# EAGLE design SparkX_smol_LiPo_Power (EAGLE 9.6.2)
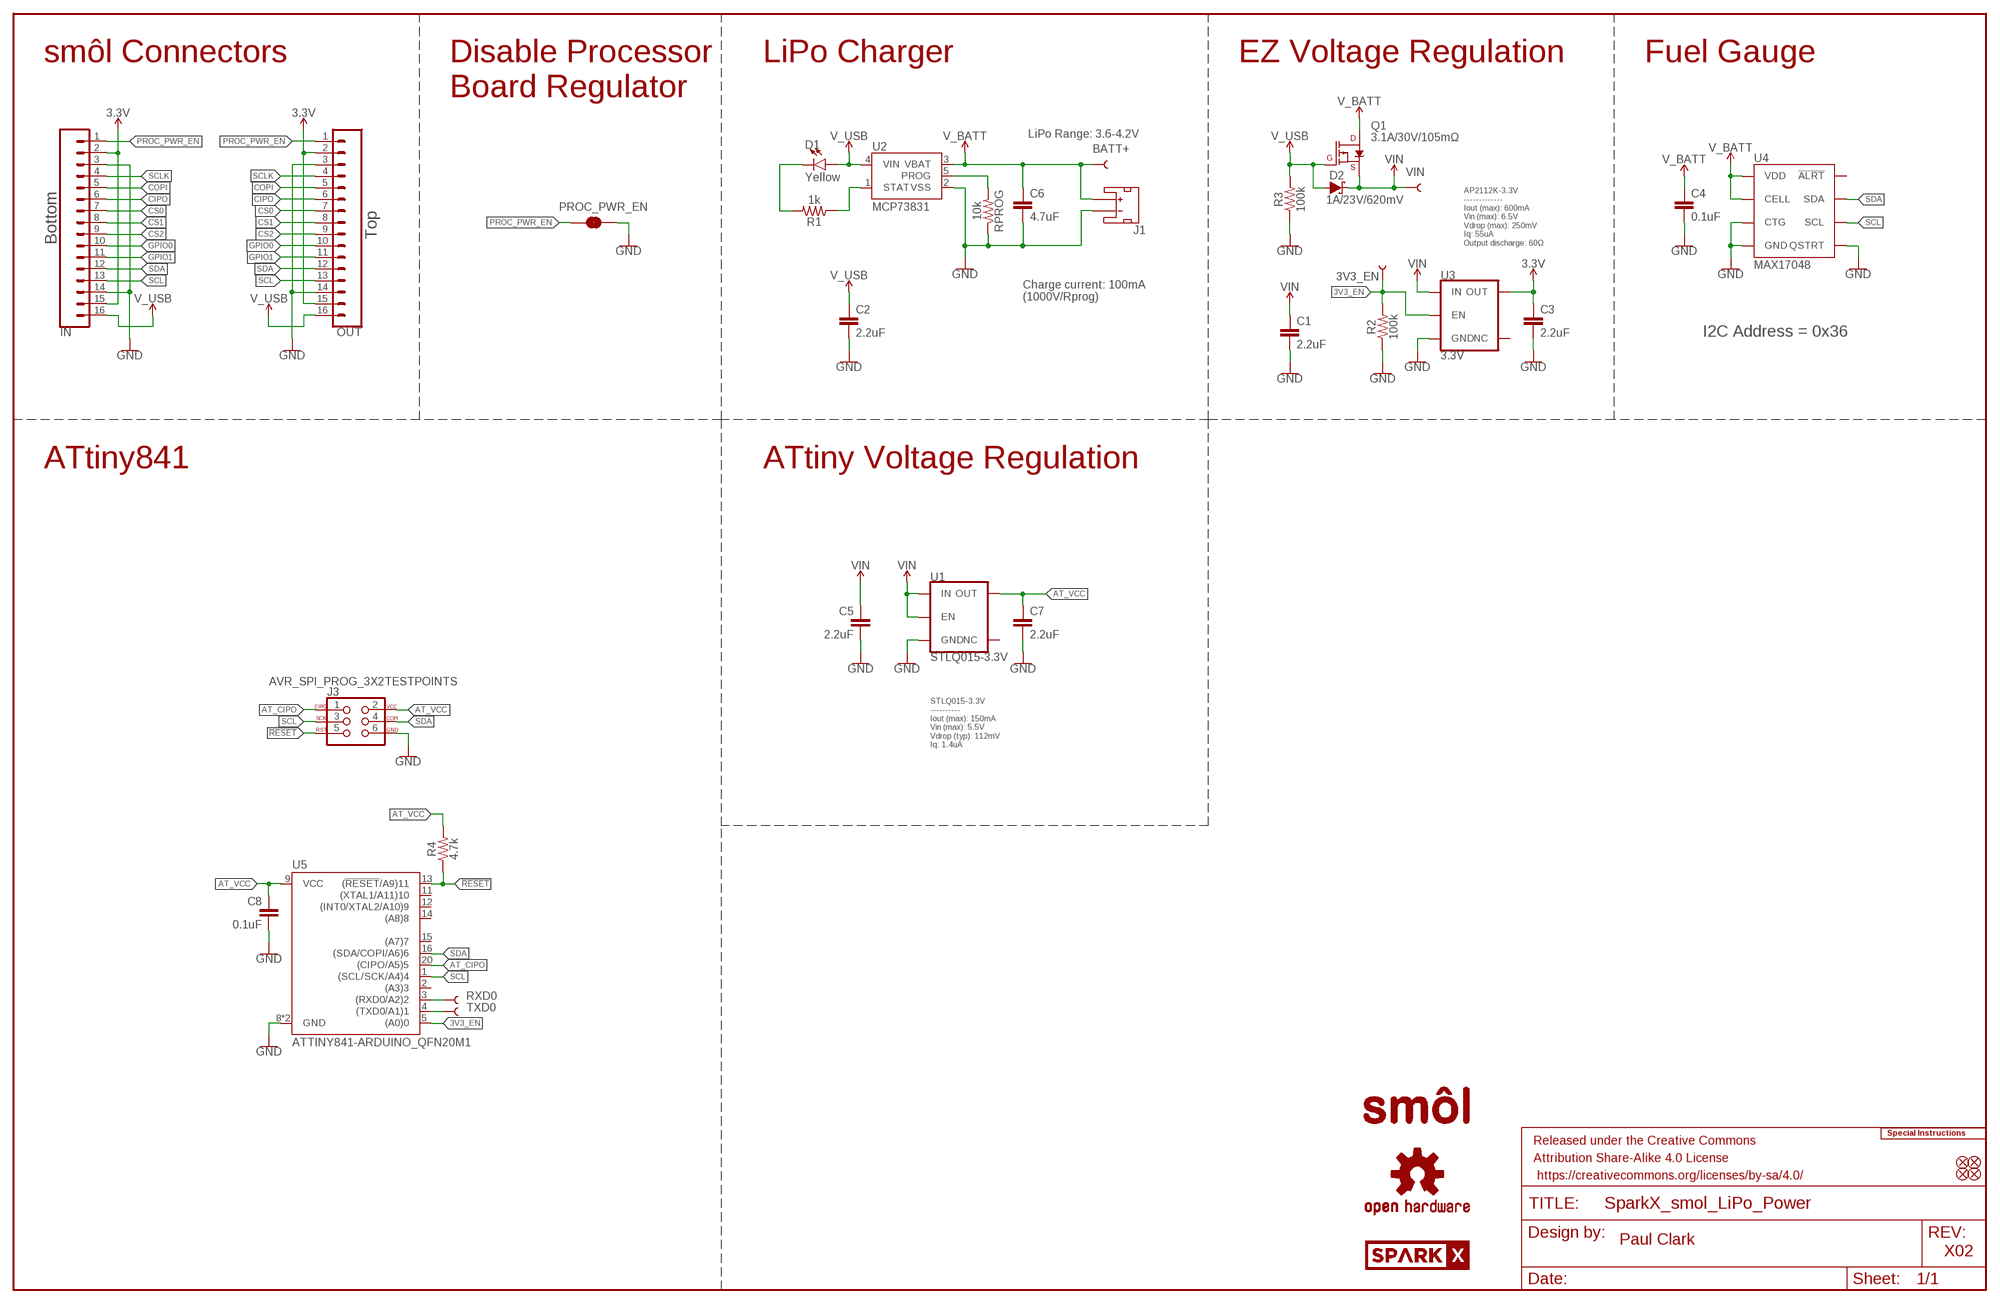
[diagram p0: schematic, sheet 1]

## Parts
3V3_EN  TEST-POINT3X4  [PAD.03X.04]
BATT+  TEST-POINT3X4  [PAD.03X.04]
C1  2.2uF  2.2UF-0402_TIGHT-10V-10%-X5R  [0402-TIGHT]
C2  2.2uF  2.2UF-0402_TIGHT-10V-10%-X5R  [0402-TIGHT]
C3  2.2uF  2.2UF-0402_TIGHT-10V-10%-X5R  [0402-TIGHT]
C4  0.1uF  0.1UF-0402T-6.3V-10%-X7R  [0402-TIGHT]
C5  2.2uF  2.2UF-0402_TIGHT-10V-10%-X5R  [0402-TIGHT]
C6  4.7uF  4.7UF-0402_TIGHT-6.3V-20%-X5R  [0402-TIGHT]
C7  2.2uF  2.2UF-0402_TIGHT-10V-10%-X5R  [0402-TIGHT]
C8  0.1uF  0.1UF-0402T-6.3V-10%-X7R  [0402-TIGHT]
D1  Yellow  LED-YELLOW0603  [LED-0603]
D2  1A/23V/620mV  DIODE-SCHOTTKY-BAT20J  [SOD-323]
FD1  FIDUCIALUFIDUCIAL  [FIDUCIAL-MICRO]
FD2  FIDUCIALUFIDUCIAL  [FIDUCIAL-MICRO]
FD3  FIDUCIALUFIDUCIAL  [FIDUCIAL-MICRO]
FD4  FIDUCIALUFIDUCIAL  [FIDUCIAL-MICRO]
FRAME1  FRAME-LEDGER  [CREATIVE_COMMONS]
IN  CONN_16FPC_16_0.5MM  [FPC_16_0.5MM]
J1  JST_2MM_MALE  [JST-2-SMD]
J3  AVR_SPI_PROG_3X2TESTPOINTS  [2X3_TEST_POINTS]
LOGO1  SPECIAL_INSTRUCTIONS-ORDERING  [ORDERING_INSTRUCTIONS]
LOGO2  OSHW-LOGOMINI  [OSHW-LOGO-MINI]
LOGO3  OSHW-LOGOMINI  [OSHW-LOGO-MINI]
OUT  CONN_16FPC_16_0.5MM  [FPC_16_0.5MM]
PROC_PWR_EN  JUMPER-SMT_2_NC_TRACE_SILK  [SMT-JUMPER_2_NC_TRACE_SILK]
Q1  3.1A/30V/105mΩ  MOSFET_PCH-DMG2307L  [SOT23-3]
R1  1k  1KOHM-0402T-1/16W-1%  [0402-TIGHT]
R2  100k  100KOHM-0402T-1/16W-1%  [0402-TIGHT]
R3  100k  100KOHM-0402T-1/16W-1%  [0402-TIGHT]
R4  4.7k  4.7KOHM-0402T-1/16W-1%  [0402-TIGHT]
RPROG  10k  10KOHM-0402T-1/16W-1%  [0402-TIGHT]
RXD0  TEST-POINT3X4  [PAD.03X.04]
TXD0  TEST-POINT3X4  [PAD.03X.04]
U1  STLQ015-3.3V  [SOT23-5]
U2  MCP73831  [SOT23-5]
U3  3.3V  V_REG_AP2112K-3.3V  [SOT23-5]
U4  MAX17048  MAX17048DFN8  [DFN-8]
U5  ATTINY841-ARDUINO_QFN20M1  [QFN20_20M1]
U$1  SPARKX-LOGO3  [SPARKX-SMALL]
U$3  SMOL_LOGOSMALL  [SMOL_SMALL]
U$9  SMOL_LOGOSMALL  [SMOL_SMALL]
VIN  TEST-POINT3X4  [PAD.03X.04]

## Nets
3.3V: C3.1 IN.2 IN.15 OUT.2 OUT.15 U3.5(OUT)
3V3_EN: 3V3_EN.1 R2.2 U3.3(EN) U5.5((A0)0)
!RESET!: J3.5 R4.1 U5.13((!RESET!/A9)11)
AT_CIPO: J3.1 U5.20((CIPO/A5)5)
AT_VCC: C7.1 C8.1 J3.2 R4.2 U1.5(OUT) U5.9(VCC)
CHG_LED: R1.1 U2.1(STAT)
CIPO: IN.6 OUT.6
COPI: IN.5 OUT.5
CS0: IN.7 OUT.7
CS1: IN.8 OUT.8
CS2: IN.9 OUT.9
GND: C1.2 C2.2 C3.2 C4.2 C5.2 C6.2 C7.2 C8.2 IN.3 IN.14 J1.1(-) J3.6 OUT.3 OUT.14 PROC_PWR_EN.2 R2.1 R3.1 RPROG.1 U1.2(GND) U2.2(VSS) U3.2(GND) U4.1(CTG) U4.4(GND) U4.6(QSTRT) U4.9(GND) U5.8(GND) U5.PAD(GND)
GPIO0: IN.10 OUT.10
GPIO1: IN.11 OUT.11
N$20: RPROG.2 U2.5(PROG)
N$21: D1.C R1.2
PROC_PWR_EN: IN.1 OUT.1 PROC_PWR_EN.1
RXD0: RXD0.1 U5.3((RXD0/A2)2)
SCL: IN.13 J3.3 OUT.13 U4.7(SCL) U5.1((SCL/SCK/A4)4)
SCLK: IN.4 OUT.4
SDA: IN.12 J3.4 OUT.12 U4.8(SDA) U5.16((SDA/COPI/A6)6)
TXD0: TXD0.1 U5.4((TXD0/A1)1)
V_BATT: BATT+.1 C4.1 C6.1 J1.2(+) Q1.3(D) U2.3(VBAT) U4.2(CELL) U4.3(VDD)
V_USB: C2.1 D1.A D2.A IN.16 OUT.16 Q1.1(G) R3.2 U2.4(VIN)
VIN: C1.1 C5.1 D2.C Q1.2(S) U1.1(IN) U1.3(EN) U3.1(IN) VIN.1
Unconnected: J1.NC1(PAD1) J1.NC2(PAD2) U1.4(NC) U3.4(NC) U4.5(!ALRT) U5.2((A3)3) U5.11((XTAL1/A11)10) U5.12((INT0/XTAL2/A10)9) U5.14((A8)8) U5.15((A7)7)

## Notes on the sheet
- smôl Connectors | LiPo Charger | EZ Voltage Regulation | Fuel Gauge
- Disable Processor
  Board Regulator
- LiPo Range: 3.6-4.2V
- AP2112K-3.3V
  -------------
  Iout (max): 600mA 
  Vin (max): 6.5V
  Vdrop (max): 250mV
  Iq: 55uA
  Output discharge: 60Ω
- Top
- Bottom
- Charge current: 100mA
  (1000V/Rprog)
- I2C Address = 0x36
- ATtiny841 | ATtiny Voltage Regulation
- STLQ015-3.3V
  ----------
  Iout (max): 150mA 
  Vin (max): 5.5V
  Vdrop (typ): 112mV
  Iq: 1.4uA
- Paul Clark
- X02

## Library data of the parts
3V3_EN BATT+ RXD0 TXD0 VIN = SparkFun-Connectors:TEST-POINT: SparkFun Test Points Bare copper test points for troubleshooting or In-Circuit-Testing. These are used by our Production team for verifying production board runs using pogo-pins on test beds. SparkFun Products: SparkFun LSM9DS1 Breakout <https://www.sparkfun.com/products/13284> SparkFun PSOC <https://www.sparkfun.com/products/13714> SparkFun Load Cell Amplifier <https://www.sparkfun.com/products/13879>
C1-C3 C5 C7 = SparkFun-Capacitors:2.2UF: 2.2µF ceramic capacitors A capacitor is a passive two-terminal electrical component used to store electrical energy temporarily in an electric field.; PROD_ID: CAP-14232
C4 C8 = SparkFun-Capacitors:0.1UF: 0.1µF ceramic capacitors A capacitor is a passive two-terminal electrical component used to store electrical energy temporarily in an electric field.; PROD_ID: CAP-14993
C6 = SparkFun-Capacitors:4.7UF: 4.7µF ceramic capacitors A capacitor is a passive two-terminal electrical component used to store electrical energy temporarily in an electric field.; PROD_ID: CAP-14240
D1 = SparkFun-LED:LED-YELLOW: Yellow SMD LED Used in manufacturing several products at SparkFun. Packages: 0603 - SMD 0603 package[Product Link] <http://www.kingbrightusa.com/product.asp?catalog_name=LED&product_id=APT1608SYCK> 0603 -SMART - SMART SMD 0603 package (more efficient/more expensive) [Product Link] <http://www.osram-os.com/osram_os/en/products/product-catalog/led-light-emitting-diodes/smartled-0603/ly-l29k/index.jsp> LilyPad - SMD1206 package[Product Datasheet] <https://www.sparkfun.com/datasheets/DevTools/LilyPad/Q150YUS4.pdf> SparkFun Products: Blynk Board <https://www.sparkfun.com/products/13794> IOIO-OTG <https://www.sparkfun.com/products/13613> XBee Explorer Serial <https://www.sparkfun.com/products/13225>; PROD_ID: DIO-09003
D2 = SparkFun-DiscreteSemi:DIODE-SCHOTTKY: Schottky diode A Schottky diode is a semiconductor diode which has a low forward voltage drop and a very fast switching action.; PROD_ID: DIO-11623
FD1-FD4 = SparkFun-Aesthetics:FIDUCIAL: Fiducial Alignment Points Point-of-reference for pick-and-place machines and other optical instruments.
FRAME1 = SparkFun-Aesthetics:FRAME-LEDGER: Schematic Frame - Ledger Standard 11x14 US Ledger frame
IN OUT = SparkFun-Connectors:CONN_16: Multi connection point. Often used as Generic Header-pin footprint for 0.1 inch spaced/style header connections On any of the 0.1 inch spaced packages, you can populate with these: Break Away Headers - Straight <https://www.sparkfun.com/products/116> (PRT-00116) Break Away Male Headers - Right Angle <https://www.sparkfun.com/products/553> (PRT-00553) Female Headers <https://www.sparkfun.com/products/115> (PRT-00115) Break Away Headers - Machine Pin <https://www.sparkfun.com/products/117> (PRT-00117) Break Away Female Headers - Swiss Machine Pin <https://www.sparkfun.com/products/743> (PRT-00743) For SCREWTERMINALS and SPRING TERMINALS visit here: Screw Terimnals on SparkFun.com <https://www.sparkfun.com/search/results?term=Screw+Terminals> (5mm/3.5mm/2.54mm spacing) This device is also useful as a general connection point to wire up your design to another part of your project. Our various solder wires solder well into these plated through hole pads. Hook-Up Wire - Assortment (Stranded, 22 AWG) <https://www.sparkfun.com/products/11375> (PRT-11375) Hook-Up Wire - Assortment (Solid Core, 22 AWG) <https://www.sparkfun.com/products/11367> (PRT-11367) View the entire wire category on our website here <https://www.sparkfun.com/categories/141> Special notes: Molex polarized connector foot print use with SKU : PRT-08231 with associated crimp pins and housings. 1MM SMD Version SKU: PRT-10208 NOTES ON THE VARIANTS LOCK and LOCK_LONGPADS... This footprint was designed to help hold the alignment of a through-hole component (i.e. 6-pin header) while soldering it into place. You may notice that each hole has been shifted either up or down by 0.005 of an inch from it's more standard position (which is a perfectly straight line). This slight alteration caused the pins (the squares in the middle) to touch the edges of the holes. Because they are alternating, it causes a "brace" to hold the component in place. 0.005 has proven to be the perfect amount of "off-center" position when using our standard breakaway headers. Although looks a little odd when you look at the bare footprint, once you have a header in there, the alteration is very hard to notice. Also,if you push a header all the way into place, it is covered up entirely on the bottom side.; PROD_ID: CONN-16066
J1 = SparkFun-Connectors:JST_2MM_MALE: JST 2MM MALE RA CONNECTOR Two pin, compact surface mount connector. Commonly used as a battery input connection point. We really like the solid locking feeling and high current rating on these small connectors. We use these all the time as battery connectors. Mates to single-cell LiPo batteries. Here is the connector we sell at SparkFun: JST Right Angle Connector - White <https://www.sparkfun.com/products/8612> (PRT-08612) Datasheet <http://www.sparkfun.com/datasheets/Prototyping/Connectors/JST-Horizontal.pdf> It was used on these SparkFun products: SparkFun MOSFET Power Controller <https://www.sparkfun.com/products/11214> (PRT-11214) SparkFun Battery Babysitter - LiPo Battery Manager <https://www.sparkfun.com/products/13777> (PRT-13777) And many, many others that required a lipo battery connection.; PROD_ID: CONN-11443; SF_ID: PRT-08612
J3 = SparkFun-Connectors:AVR_SPI_PROG_3X2: AVR ISP 6 Pin This is the reduced ISP connector for AVR programming. Common on Arduino. This footprint will take up less PCB space and can be used with a 10-pin to 6-pin adapter such as SKU: BOB-08508 **Special note about "TEST_POINT" package. The stop mask is on the top side, so if you want your programming test points to be on the bottom of your board, make sure to place this package on the bottom side of the board. This also ensure that the orientation to program from the bottom side will be correct. SparkFun Products: SparkFun ISP Pogo Adapter <https://www.sparkfun.com/products/11591> - NS Tiny AVR Programmer <https://www.sparkfun.com/products/11801> -PTH
LOGO1 = SparkFun-Aesthetics:SPECIAL_INSTRUCTIONS: Special Ordering/Production Instructions Alert Symbol for special PCB ordering instructions or unique production process warnings. Ordering Instructions Production Instructions Types of information that should be added to box: Copper weight Soldermask color Silk color PCB thickness Number of layers PCB Standard: 1.6mm FR4 1 oz copper immersion silver plating red soldermask white silkscreen Types of information that should be added to box: Special wash requirements Depaneling instructions Humidification Glue curing Default text settings: 0.07 inch 9% ratio 50% line distance
LOGO2 LOGO3 = SparkFun-Aesthetics:OSHW-LOGO: Open-Source Hardware (OSHW) Logo This logo indicates the piece of hardware it is found on incorporates a OSHW license and/or adheres to the definition of open source hardware found here: http://freedomdefined.org/OSHW
PROC_PWR_EN = SparkFun-Jumpers:JUMPER-SMT_2_NC_TRACE: Normally closed trace jumper This jumper has a trace between two pads so it's normally closed (NC). Use a razor knife to open the connection. For best results follow the IPC guidelines for cutting traces: Cutout at least 0.063 mm (0.005 in). Remove all loose material to clean up the cut area. Seal the cut with an approved epoxy. Reapply solder to reclose the connection.
Q1 = SparkFun-DiscreteSemi:MOSFET_PCH: P-channel MOSFETs Voltage controlled devices that allow control of high current outputs. SparkFun Products: SparkFun ESP32 Thing <https://www.sparkfun.com/products/13907> SparkFun ESP8266 Thing <https://www.sparkfun.com/products/13231> SparkFun Pi Servo HAT V2 <https://www.sparkfun.com/products/15316> DMG2305UX-7 (20V/4.2A/SOT23-3); PROD_ID: TRANS-11308
R1 = SparkFun-Resistors:1KOHM: 1kΩ resistor A resistor is a passive two-terminal electrical component that implements electrical resistance as a circuit element. Resistors act to reduce current flow, and, at the same time, act to lower voltage levels within circuits. - Wikipedia; PROD_ID: RES-14342
R2 R3 = SparkFun-Resistors:100KOHM: 100kΩ resistor A resistor is a passive two-terminal electrical component that implements electrical resistance as a circuit element. Resistors act to reduce current flow, and, at the same time, act to lower voltage levels within circuits. - Wikipedia; PROD_ID: RES-13495
R4 = SparkFun-Resistors:4.7KOHM: 4.7kΩ resistor A resistor is a passive two-terminal electrical component that implements electrical resistance as a circuit element. Resistors act to reduce current flow, and, at the same time, act to lower voltage levels within circuits. - Wikipedia; PROD_ID: RES-15343
RPROG = SparkFun-Resistors:10KOHM: 10kΩ resistor A resistor is a passive two-terminal electrical component that implements electrical resistance as a circuit element. Resistors act to reduce current flow, and, at the same time, act to lower voltage levels within circuits. - Wikipedia; PROD_ID: RES-14241
U1 = SparkFun-IC-Power:STLQ015: STLQ015 - 150mA CMOS LDO Regulator w/ Enable 1.4uA quiescent; PROD_ID: IC-15779
U2 = SparkFun-IC-Power:MCP73831: MCP73831T Li-Ion, Li-Pol Controller Miniature single cell, fully integrated Li-Ion, Li-polymer charge management controller Datasheet <http://ww1.microchip.com/downloads/en/DeviceDoc/20001984g.pdf> SparkFun Products: SparkFun ESP32 Thing <https://www.sparkfun.com/products/13907> SparkFun 9DoF Razor IMU M0 <https://www.sparkfun.com/products/14001>; PROD_ID: IC-09995
U3 = SparkFun-IC-Power:V_REG_AP2112: AP2112 - 600mA CMOS LDO Regulator w/ Enable The AP2112 is CMOS process low dropout linear regulator with enable function, the regulator delivers a guaranteed 600mA (min.) continuous load current. Features Output Voltage Accuracy: ±1.5% Output Current: 600mA (Min.) Foldback Short Current Protection: 50mA Enable Function to Turn ON/OFF VOUT Low Dropout Voltage (3.3V): 250mV (Typ.) @IOUT=600mA Excellent Load Regulation: 0.2%/A (Typ.) Excellent Line Regulation: 0.02%/V (Typ.) Low Quiescent Current: 55μA (Typ.) Low Standby Current: 0.01μA (Typ.) Low Output Noise: 50μVRMS PSRR: 100Hz -65dB, 1kHz -65dB OTSD Protection Stable with 1.0μF Flexible Cap: Ceramic, Tantalum and Aluminum Electrolytic Operation Temperature Range: -40°C to 85°C ESD: MM 400V, HBM 4000V; PROD_ID: VREG-12457
U4 = SparkFun-IC-Power:MAX17048: Micropower 1-Cell Li+ ModelGauge SparkFun Products Qduino Mini <https://www.sparkfun.com/products/13614> (DEV-13614); PROD_ID: IC-12551
U5 = SparkFun-IC-Microcontroller:ATTINY841-ARDUINO: ATtiny841; DIGIKEY_PART: ATTINY841-MU-ND; PROD_ID: IC-16067
U$1 = SparkX:SPARKX-LOGO
U$3 U$9 = SparkX:SMOL_LOGO

## Net classes
1 Power: width 0.305 mm
2 3.3V: width 0.508 mm

## Board
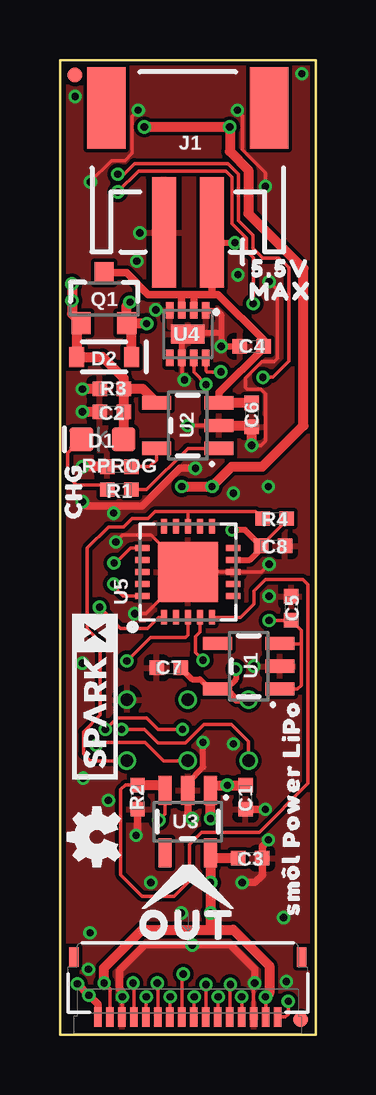
[diagram p1: board, top side]
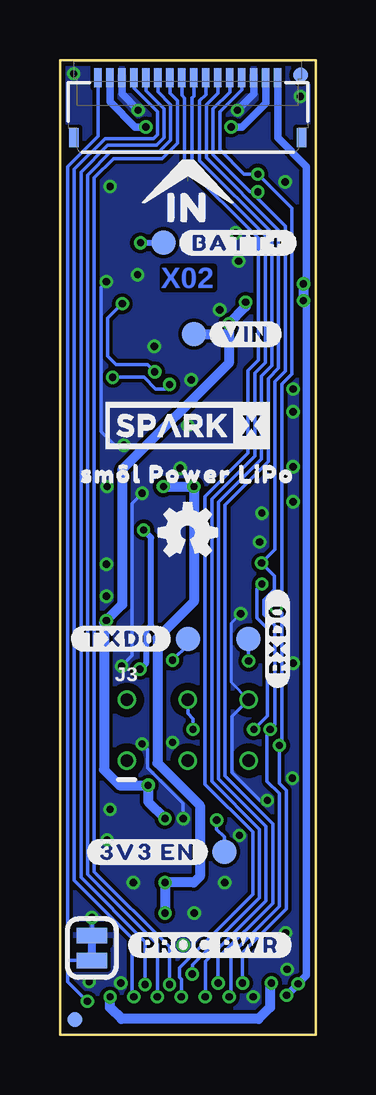
[diagram p2: board, bottom side, seen from below]

Size 10.67 x 40.64 mm. Coordinates in mm from the lower left corner, seen from the top.
Outline: 0,40.64 0,0 10.67,0 10.67,40.64 0,40.64
Copper layers (1*16): Top 0.035mm / dielectric 1.5mm / Bottom 0.035mm
Design rules "SparkFun-2-Layer-Minimum-JLCPCB": minimum track width 5mil, minimum drill 0.3mm, track to track 5mil, track to pad 5mil, pad to pad 5mil, via to via 5mil, smd to smd 5mil, copper to edge 7mil, drill to drill 7mil, minimum pad ring 5mil, minimum via ring 5mil, stop-mask expansion 2.5mil, vias tented up to drill 25mil, thermal gap 10mil
bRestrict: area 2.3,13.5 to 3.3,14.5; area 4.8,13.5 to 5.8,14.5; area 7.4,13.5 to 8.4,14.5; area 7.4,10.9 to 8.4,11.9; area 4.8,10.9 to 5.8,11.9; area 2.3,10.9 to 3.3,11.9

### Footprints (pad centres in the part's own frame; a part is rotated, then mirrored left to right if it is on the bottom)
PAD.03X.04 = smd 1.016 x 1.016: 1 0,0
0402-TIGHT = smd 0.6 x 0.6: 1 -0.5,0; 2 0.5,0
LED-0603 = smd 1 x 1: A -0.877,0; C 0.877,0
SOD-323 = smd 0.63 x 0.83: A 1.15,0; C -1.15,0
FIDUCIAL-MICRO = smd 0.635 x 0.635: 1 0,0
FPC_16_0.5MM = smd 0.3 x 0.8: 1 -3.75,1.35; 2 -3.25,1.35; 3 -2.75,1.35; 4 -2.25,1.35; 5 -1.75,1.35; 6 -1.25,1.35; 7 -0.75,1.35; 8 -0.25,1.35; 9 0.25,1.35; 10 0.75,1.35; 11 1.25,1.35; 12 1.75,1.35; 13 2.25,1.35; 14 2.75,1.35; 15 3.25,1.35; 16 3.75,1.35 | smd 0.4 x 0.8: MP1 -4.75,-1.15; MP2 4.75,-1.15
JST-2-SMD = smd 1 x 4.6: 1 -1,-3.7; 2 1,-3.7 | smd 1.6 x 3.4: NC1 -3.4,1.5; NC2 3.4,1.5
2X3_TEST_POINTS = drill 0.508: 1 -2.54,-1.27; 2 -2.54,1.27; 3 0,-1.27; 4 0,1.27; 5 2.54,-1.27; 6 2.54,1.27
SMT-JUMPER_2_NC_TRACE_SILK = smd 0.66 x 1.27: 1 -0.521,0; 2 0.521,0
SOT23-3 = smd 0.8 x 0.9: 1 -0.95,-1; 2 0.95,-1; 3 0,1.1
SOT23-5 = smd 0.55 x 1.2: 1 -0.95,-1.3; 2 0,-1.3; 3 0.95,-1.3; 4 0.95,1.3; 5 -0.95,1.3
DFN-8 = smd 0.3 x 0.7: 1 -0.75,-0.99; 2 -0.25,-0.99; 3 0.25,-0.99; 4 0.75,-0.99; 5 0.75,0.99; 6 0.25,0.99; 7 -0.25,0.99; 8 -0.75,0.99 | smd 1.38 x 0.8: 9 0,0
QFN20_20M1 = smd 0.6 x 0.25: 1 -1.9,1; 2 -1.9,0.5; 3 -1.9,0; 4 -1.9,-0.5; 5 -1.9,-1; 11 1.9,-1; 12 1.9,-0.5; 13 1.9,0; 14 1.9,0.5; 15 1.9,1 | smd 0.25 x 0.6: 6 -1,-1.9; 7 -0.5,-1.9; 8 0,-1.9; 9 0.5,-1.9; 10 1,-1.9; 16 1,1.9; 17 0.5,1.9; 18 0,1.9; 19 -0.5,1.9; 20 -1,1.9 | smd 2.5 x 2.5: PAD 0,0

### Placement (x,y rotation side)
3V3_EN  3.81,7.62 0 bottom
BATT+  6.35,33.02 0 bottom
C1  7.75,9.91 270 top
C2  2.16,25.97 180 top
C3  7.94,7.37 0 top
C4  8,28.7 180 top
C5  9.65,17.78 90 top
C6  8,25.84 270 top
C7  4.54,15.3 180 top
C8  8.89,20.38 0 top
D1  1.78,24.83 180 top
D2  1.84,28.26 180 top
FD1  0.64,40.01 0 top
FD2  0.64,40.01 0 bottom
FD3  10.03,0.64 0 top
FD4  10.03,0.64 0 bottom
FRAME1  45.72,-10.16 0 top  (outside the outline)
IN  5.33,38.54 0 bottom
J1  5.33,37.15 0 top
J3  5.33,12.7 0 bottom
LOGO1  19.05,50.8 0 top  (outside the outline)
LOGO2  1.52,8.26 90 top
LOGO3  5.33,20.95 0 bottom
OUT  5.33,2.1 180 top
PROC_PWR_EN  9.33,3.62 90 bottom
Q1  1.84,30.67 0 top
R1  2.48,22.73 180 top
R2  3.24,9.91 90 top
R3  2.16,26.92 0 top
R4  8.95,21.53 0 top
RPROG  2.48,23.69 0 top
RXD0  2.79,16.51 0 bottom
TXD0  5.33,16.51 0 bottom
U1  7.87,15.37 90 top
U2  5.33,25.4 90 top
U3  5.33,8.89 180 top
U4  5.33,29.21 180 top
U5  5.33,19.3 90 top
U$1  1.46,14.1 90 top
U$2  [SM�L_POWER_LIPO0]  5.33,23.37 0 bottom
U$3  5.33,6.41 0 top
U$4  [#BATT##0]  3.24,33.02 0 bottom
U$5  [#VIN#0]  2.92,29.21 0 bottom
U$6  [#3V3_EN#0]  7.02,7.62 0 bottom
U$7  [#PROC_PWR#0]  4.41,3.75 0 bottom
U$8  [IN0]  5.33,34.48 0 bottom
U$9  5.33,35.81 0 bottom
U$10  [CHG0]  0.57,22.67 90 top
U$11  [MAX0]  9.21,30.99 0 top
U$14  [#RXD0#0]  1.59,16.51 90 bottom
U$15  [#TXD0#0]  8.13,16.51 0 bottom
U$16  [5#5V0]  9.21,31.94 0 top
U$17  [OUT0]  5.33,4.57 0 top
U$18  [SM�L_POWER_LIPO0]  9.65,9.46 90 top
U$20  SPARKX-LOGO3  [SPARKX-SMALL]  5.33,25.4 0 bottom
VIN  5.08,29.21 0 bottom

### Tracks (layer width: path | path; a pad name or v marks a point on that pad's centre or on a via)
3.3V  (via drill 0.3)
  Top 0.152: OUT.2 v8.58,1.58 | OUT.15 2.08,1.92 v1.84,2.16
  Top 0.406: C3.1 6.51,7.37 U3.5 v6.29,6.35 v6.29,5.08 6.29,4.38 | v1.84,2.16 1.84,2.79 3.43,4.38 6.29,4.38 | 6.29,4.38 7.24,4.38 8.73,2.88 8.73,1.73 v8.58,1.58 | v3.52,37.85 v7.08,37.85 7.08,36.83 7.86,36.05 7.86,34.24 10.16,31.94 10.16,25.4 8.45,23.69 7.18,23.69 v6.35,22.86 v5.08,22.86
  Bottom 0.305: IN.15 2.08,38.84 3.08,37.85 v3.52,37.85 | v7.08,37.85 7.53,37.85 8.58,38.9 IN.2
  Bottom 0.406: v1.84,2.16 1.91,2.1 1.91,1.14 2.38,0.66 8.1,0.66 8.58,1.14 v8.58,1.58 | v6.35,22.86 v5.08,22.86 5.08,18.06 6.6,16.54 6.6,11.34 4.83,9.56 4.83,6.6 5.08,6.35 v6.29,6.35 v6.29,5.08
3V3_EN  (via drill 0.3)
  Top 0.152: R2.2 2.73,10.41 2.54,10.22 2.54,6.67 3.43,5.78 4.76,5.78 5.4,6.41 5.4,7.94 5.91,8.45 8.32,8.45 10.35,10.47 10.35,18.77 10.13,18.99 8.57,18.99 8.1,18.51 8.1,17.97 7.53,17.4 U5.5 | U3.3 4.38,9.21 v4.13,8.95
  Top 0.406: U3.3 4.17,10.41 R2.2
  Bottom 0.152: v4.13,8.95 4.13,8.57 3.81,8.26 3V3_EN.1
!RESET!
  Top 0.152: J3.5 1.27,11.43 0.98,11.72 0.98,12.64 1.68,13.34 1.68,16.38 1.14,16.92 1.14,20.29 2.03,21.17 2.66,21.17 3.01,21.53 3.69,21.53 3.98,21.82 5.33,21.82 | R4.1 8.16,21.82 5.33,21.82 | U5.13 5.33,21.82
AT_CIPO  (via drill 0.3)
  Top 0.152: v2.58,12.74 3.53,12.74 4.1,12.16 5.24,12.16 6.02,12.94 7.17,12.94 7.87,12.23 J3.1 | U5.20 2.64,18.3 2.24,18.71 v2.24,18.8
  Bottom 0.152: v2.58,12.74 2.01,13.3 2.01,16.94 2.45,17.38 2.45,18.59 v2.24,18.8
AT_VCC  (via drill 0.3)
  Top 0.152: R4.2 9.45,21.45 C8.1
  Top 0.254: U5.9 7.93,19.8 8.39,20.27 C8.1 7.72,21.05 v7.18,21.05 | C7.1 5.52,14.83 5.84,14.83 6.25,14.42 U1.5 6.92,14.42 7.33,14.83 v7.33,15.24
  Top 0.305: J3.2 7.37,13.97 6.92,14.42
  Bottom 0.254: v7.33,15.24 7.06,15.51 7.06,16.88 6.86,17.08 6.86,20.73 v7.18,21.05
CHG_LED
  Top 0.152: R1.1 3.62,22.73 5.34,24.45 U2.1
CIPO  (via drill 0.3)
  Top 0.152: OUT.6 6.58,1.57 v6.6,1.59
  Bottom 0.152: IN.6 6.58,39.32 6.05,38.78 6.05,37.29 6.53,36.81 8.55,36.81 9.51,35.85 9.51,6.68 6.6,3.77 v6.6,1.59
COPI  (via drill 0.3)
  Top 0.152: OUT.5 7.08,2.07 v7.11,2.1
  Bottom 0.152: IN.5 7.08,39.36 6.33,38.6 6.33,37.4 6.64,37.09 8.67,37.09 9.79,35.96 9.79,6.57 7.11,3.89 v7.11,2.1
CS0  (via drill 0.3)
  Top 0.152: OUT.7 6.08,2.08 v6.1,2.1
  Bottom 0.152: IN.7 6.08,39.26 5.77,38.94 5.77,37.17 6.41,36.53 8.44,36.53 9.23,35.73 9.23,6.8 6.1,3.66 v6.1,2.1
CS1  (via drill 0.3)
  Top 0.152: OUT.8 5.58,1.57 v5.6,1.59
  Bottom 0.152: IN.8 5.58,39.16 5.46,39.04 5.46,36.28 2.38,33.21 2.38,28.13 2.81,27.7 2.81,24.24 4.61,22.45 4.61,10.45 2.62,8.46 2.62,5.87 5.69,2.8 5.69,2.4 5.6,2.32 v5.6,1.59
CS2  (via drill 0.3)
  Top 0.152: OUT.9 5.08,2.48 v5.14,2.54
  Bottom 0.152: v5.14,2.54 5.14,2.91 2.35,5.71 2.35,8.57 4.33,10.56 4.33,22.33 2.54,24.13 2.54,27.59 2.1,28.02 2.1,33.32 5.15,36.37 5.15,39.07 5.08,39.13 IN.9
GND  (via drill 0.3)
  Top 0.152: v8.13,2.16 8.06,2.1 8.06,0.77 OUT.3 | OUT.14 2.58,1.57 v2.6,1.59 | U2.2 v5.33,25.4 | v3.27,38.54 3.02,38.3 3.02,36.75 2.71,36.44 2.15,36.44 v1.27,35.56 | v7.4,38.54 7.62,38.33 7.62,36.9 8.57,35.95 v8.57,35.37 | U4.4 4.03,30.2 v4,30.23 | U4.6 5.08,27.41 v5.19,27.3 | v8.73,31.4 9.08,31.05 9.08,28.19 8.95,28.07 8.43,28.07 7.75,27.38 7.75,26.99 7.81,26.92 8.38,26.92 8.57,26.73 8.57,24.77 8.38,24.57 v8,24.57 | v2.33,20.54 2.62,20.83 3.81,20.83 U5.PAD | U5.PAD U5.8 8.41,19.3 v8.73,19.62 | v3.13,17.56 3.59,17.56 U5.PAD
  Top 0.254: U4.1 6.57,30.2 6.73,30.04 6.73,29.27 | 6.73,29.27 v6.73,28.7 C4.2 | 6.73,29.27 5.4,29.27 U4.9 5.08,28.96 U4.6 | U3.2 5.33,10.53 5.97,11.17 v5.97,12.19
  Top 0.305: v5.65,23.62 5.01,23.62 3.43,22.05 1.12,22.05 v0.94,22.23 | v2.6,1.59 2.6,1.82 2.49,1.93 2.49,2.68 3.56,3.75 v5.52,3.75 7.11,3.75 8.13,2.73 v8.13,2.16 | C1.2 v8.56,9.41 v8.57,9.4 | R2.1 3.24,8.38 v3.17,8.32 | v7.61,6.35 8.13,6.35 8.44,6.66 C3.2 8.44,7.87 v8.7,8.13 | U3.2 5.33,9.21 v5.52,9.02
  Top 0.406: R3.1 v0.94,26.92 | C2.2 v0.94,25.97 | RPROG.1 v0.94,23.69 | U2.2 7.95,25.4 C6.2 v8,24.57
  Bottom 0.127: v3.13,17.56 3.51,17.18 3.51,14.69 J3.6
  Bottom 0.152: PROC_PWR_EN.2 v9.34,4.89 | v2.02,9.78 2.33,9.78 3.5,10.95 3.5,13.27 J3.6 | v5.52,9.02 5.52,9.65 7.01,11.14 7.01,11.9 v7.24,12.13 | v8.73,31.4 8.95,31.18 8.95,25.16 8.37,24.57 v8,24.57 | v7.24,22.57 7.66,22.16 7.66,15.81 v8.1,15.37
  Bottom 0.305: IN.14 2.58,39.23 v3.27,38.54 | IN.3 8.08,39.23 v7.4,38.54
  other vias: 3.33,33.43 0.94,15.49 8.7,22.86 0.97,10.7 1.25,4.25 1.19,2.73 3.79,6.35 5.06,5.08 10.1,40.07 0.64,39.12 9.45,2.22 3.21,32.26 2.24,21.75 8.73,18.29 7.43,31.69
  pour Top (isolate 0.152, rank 3): 0,40.64 10.67,40.64 10.67,0 0,0
  pour Bottom (isolate 0.152, rank 2): 0,40.64 10.67,40.64 10.67,0 0,0
GPIO0  (via drill 0.3)
  Top 0.152: OUT.10 4.58,1.57 v4.6,1.59
  Bottom 0.152: IN.10 4.58,39.2 4.84,38.94 4.84,36.45 1.82,33.44 1.82,27.9 2.26,27.47 2.26,24.01 4.05,22.21 4.05,10.68 2.06,8.69 2.06,5.6 4.6,3.06 v4.6,1.59
GPIO1  (via drill 0.3)
  Top 0.152: OUT.11 4.08,2.14 v4.06,2.16
  Bottom 0.152: IN.11 4.08,39.26 4.56,38.78 4.56,36.57 1.54,33.55 1.54,27.79 1.98,27.35 1.98,23.9 3.78,22.1 3.78,10.79 1.79,8.8 1.79,5.48 4.06,3.2 v4.06,2.16
N$20
  Top 0.152: RPROG.2 3.75,23.69 4.03,23.97 U2.5
N$21
  Top 0.152: D1.C 0.32,24.25 0.32,23.3 0.7,22.92 1.79,22.92 R1.2
PROC_PWR_EN  (via drill 0.3)
  Top 0.152: v9.53,1.4 9.53,0.87 9.4,0.75 OUT.1
  Bottom 0.152: 10.35,3.11 10.35,36.2 9.08,37.46 IN.1 | PROC_PWR_EN.1 10.34,3.1 10.35,3.11 | v9.53,1.4 10.35,2.22 10.35,3.11
RXD0  (via drill 0.3)
  Top 0.152: U5.3 5.33,16.67 5.24,16.57 3.78,16.57 v2.79,15.59
  Bottom 0.152: v2.79,15.59 RXD0.1
SCL  (via drill 0.3)
  Top 0.152: OUT.13 3.08,2.12 v3.05,2.16 | v2.41,35.88 2.67,35.88 3.11,36.32 7.02,36.32 7.46,35.88 7.46,33.94 8.06,33.34 8.06,32.8 8.47,32.38 9.14,32.38 9.55,31.98 9.55,28.08 8.88,27.41 v8.47,27.41 | J3.3 4.32,11.43 3.56,12.19 1.64,12.19 v1.51,12.06 | U4.7 5.58,27.63 v6.1,27.11 | v1.65,17.83 2.54,16.94 3.65,16.94 4.11,17.4 U5.1
  Bottom 0.152: IN.13 3.08,39.41 4,38.49 4,36.89 2.98,35.88 v2.41,35.88 0.99,34.46 0.99,27.55 1.42,27.12 1.42,18.06 v1.65,17.83 1.42,17.6 1.42,12.16 v1.51,12.06 1.51,10.48 1.23,10.2 1.23,5.25 3.05,3.43 v3.05,2.16 | v6.1,27.11 6.29,26.92 6.68,26.92 7.17,27.41 v8.47,27.41
SCLK  (via drill 0.3)
  Top 0.152: OUT.4 v7.58,1.59 | v7.58,1.59
  Bottom 0.152: IN.4 7.58,39.47 6.61,38.49 6.61,37.52 6.76,37.37 8.79,37.37 10.07,36.08 10.07,6.45 7.65,4.03 7.65,1.65 v7.58,1.59
SDA  (via drill 0.3)
  Top 0.152: OUT.12 3.58,1.57 v3.6,1.59 | v2.41,35.14 3.27,36.01 6.92,36.01 7.18,35.75 7.18,33.83 7.78,33.22 7.78,32.68 8.06,32.4 v8.06,30.48 | v1.9,12.74 2.38,13.22 3.61,13.22 4.1,12.73 v5.11,12.73 | U5.16 2.96,20.3 2.32,19.67 v2.25,19.67 | U4.8 6.08,27.7 6.14,27.64 v6.71,27.64
  Bottom 0.152: IN.12 3.58,39.3 4.28,38.6 4.28,36.68 2.74,35.14 v2.41,35.14 2.41,34.85 1.26,33.71 1.26,27.67 1.7,27.24 1.7,20.23 v2.25,19.67 1.71,19.13 1.71,18.57 2.16,18.13 2.16,17.53 1.7,17.07 1.7,12.94 v1.9,12.74 2.02,12.61 2.02,10.58 1.51,10.06 1.51,5.37 3.54,3.33 3.54,1.65 v3.6,1.59 | J3.4 5.33,13.4 5.11,13.18 v5.11,12.73 | v6.71,27.64 7.01,27.94 8.32,27.94 8.67,28.3 8.67,29.87 v8.06,30.48
TXD0  (via drill 0.3)
  Top 0.152: U5.4 5.83,16.79 5.65,16.61 5.65,15.94 v5.97,15.62
  Bottom 0.152: v5.97,15.62 5.33,16.26 TXD0.1
V_BATT  (via drill 0.3)
  Top 0.254: J1.2 6.76,33.02 v7.3,33.02
  Top 0.305: Q1.3 2.77,31.77 3.68,30.86 5.08,30.86 | 5.08,30.86 5.59,30.86 | 5.59,30.86 6.35,30.86 | U4.3 5.08,30.86 | U4.2 5.58,30.86 5.59,30.86 | J1.2 6.33,30.88 6.35,30.86 | 6.35,30.86 6.6,30.86 8.5,28.96 C4.1 8.5,28.64 6.63,26.77 U2.3
  Top 0.406: U2.3 C6.1
  Bottom 0.254: v7.3,33.02 BATT+.1
V_USB  (via drill 0.3)
  Top 0.305: OUT.16 1.58,1.27 v1.21,1.65 v0.73,2.13
  Top 0.406: v0.51,31.3 v0.51,30.61 0.51,30.06 Q1.1 0.69,29.47 D2.A 1.78,28.26 2.66,27.38 R3.2 | R3.2 C2.1 D1.A | U2.4 3.46,26.92 R3.2
  Bottom 0.305: IN.16 1.58,37.4 0.38,36.2 0.38,31.43 v0.51,31.3 | v0.51,30.61 0.38,30.48 0.38,2.48 v0.73,2.13 v1.21,1.65
  Bottom 0.406: v0.51,31.3 v0.51,30.61
VIN  (via drill 0.3)
  Top 0.152: U1.1 9.91,14.42 10.07,14.58 10.07,16.29 | 10.07,16.29 10.07,16.86 C5.1 v8.74,17.28 v8.73,17.27 | U1.3 9.2,16.29 10.07,16.29
  Top 0.406: C1.1 v6.99,10.41 6.5,10.41 U3.1 v6.29,9.02 | D2.C 2.99,29.47 Q1.2 | Q1.2 3.6,29.67 v3.62,29.65 | Q1.2 2.79,30.41 v2.92,30.54
  Bottom 0.406: v2.92,30.54 2.92,30.35 v3.62,29.65 3.62,29.21 | 3.62,29.21 3.62,28 8.06,23.56 8.06,17.94 v8.73,17.27 8.83,17.18 8.83,11.05 8.18,10.41 v6.99,10.41 6.99,9.72 v6.29,9.02 | VIN.1 3.62,29.21

### Text on the board
Bottom: X02
Measures: Dimensions in Inches
tDocu: 2-Layer Board / 0.8mm Thickness / 1oz Copper (Outer layers) / HASL Finish | Paul Clark